# EasyEDA Pro project ProPrj_基于STM32的多功能串口分析仪_2025-03-12.epro, schematic Schematic3
Board Name: 锂电池供电小板; Create Date: 2025-02-12; Page Name: P1; Project Name: 基于STM32的多功能串口分析仪; Schematic Name: Schematic3; Update Date: 2025-02-17; Company: 嘉立创EDA; Page Size: A4; Version: V1.0
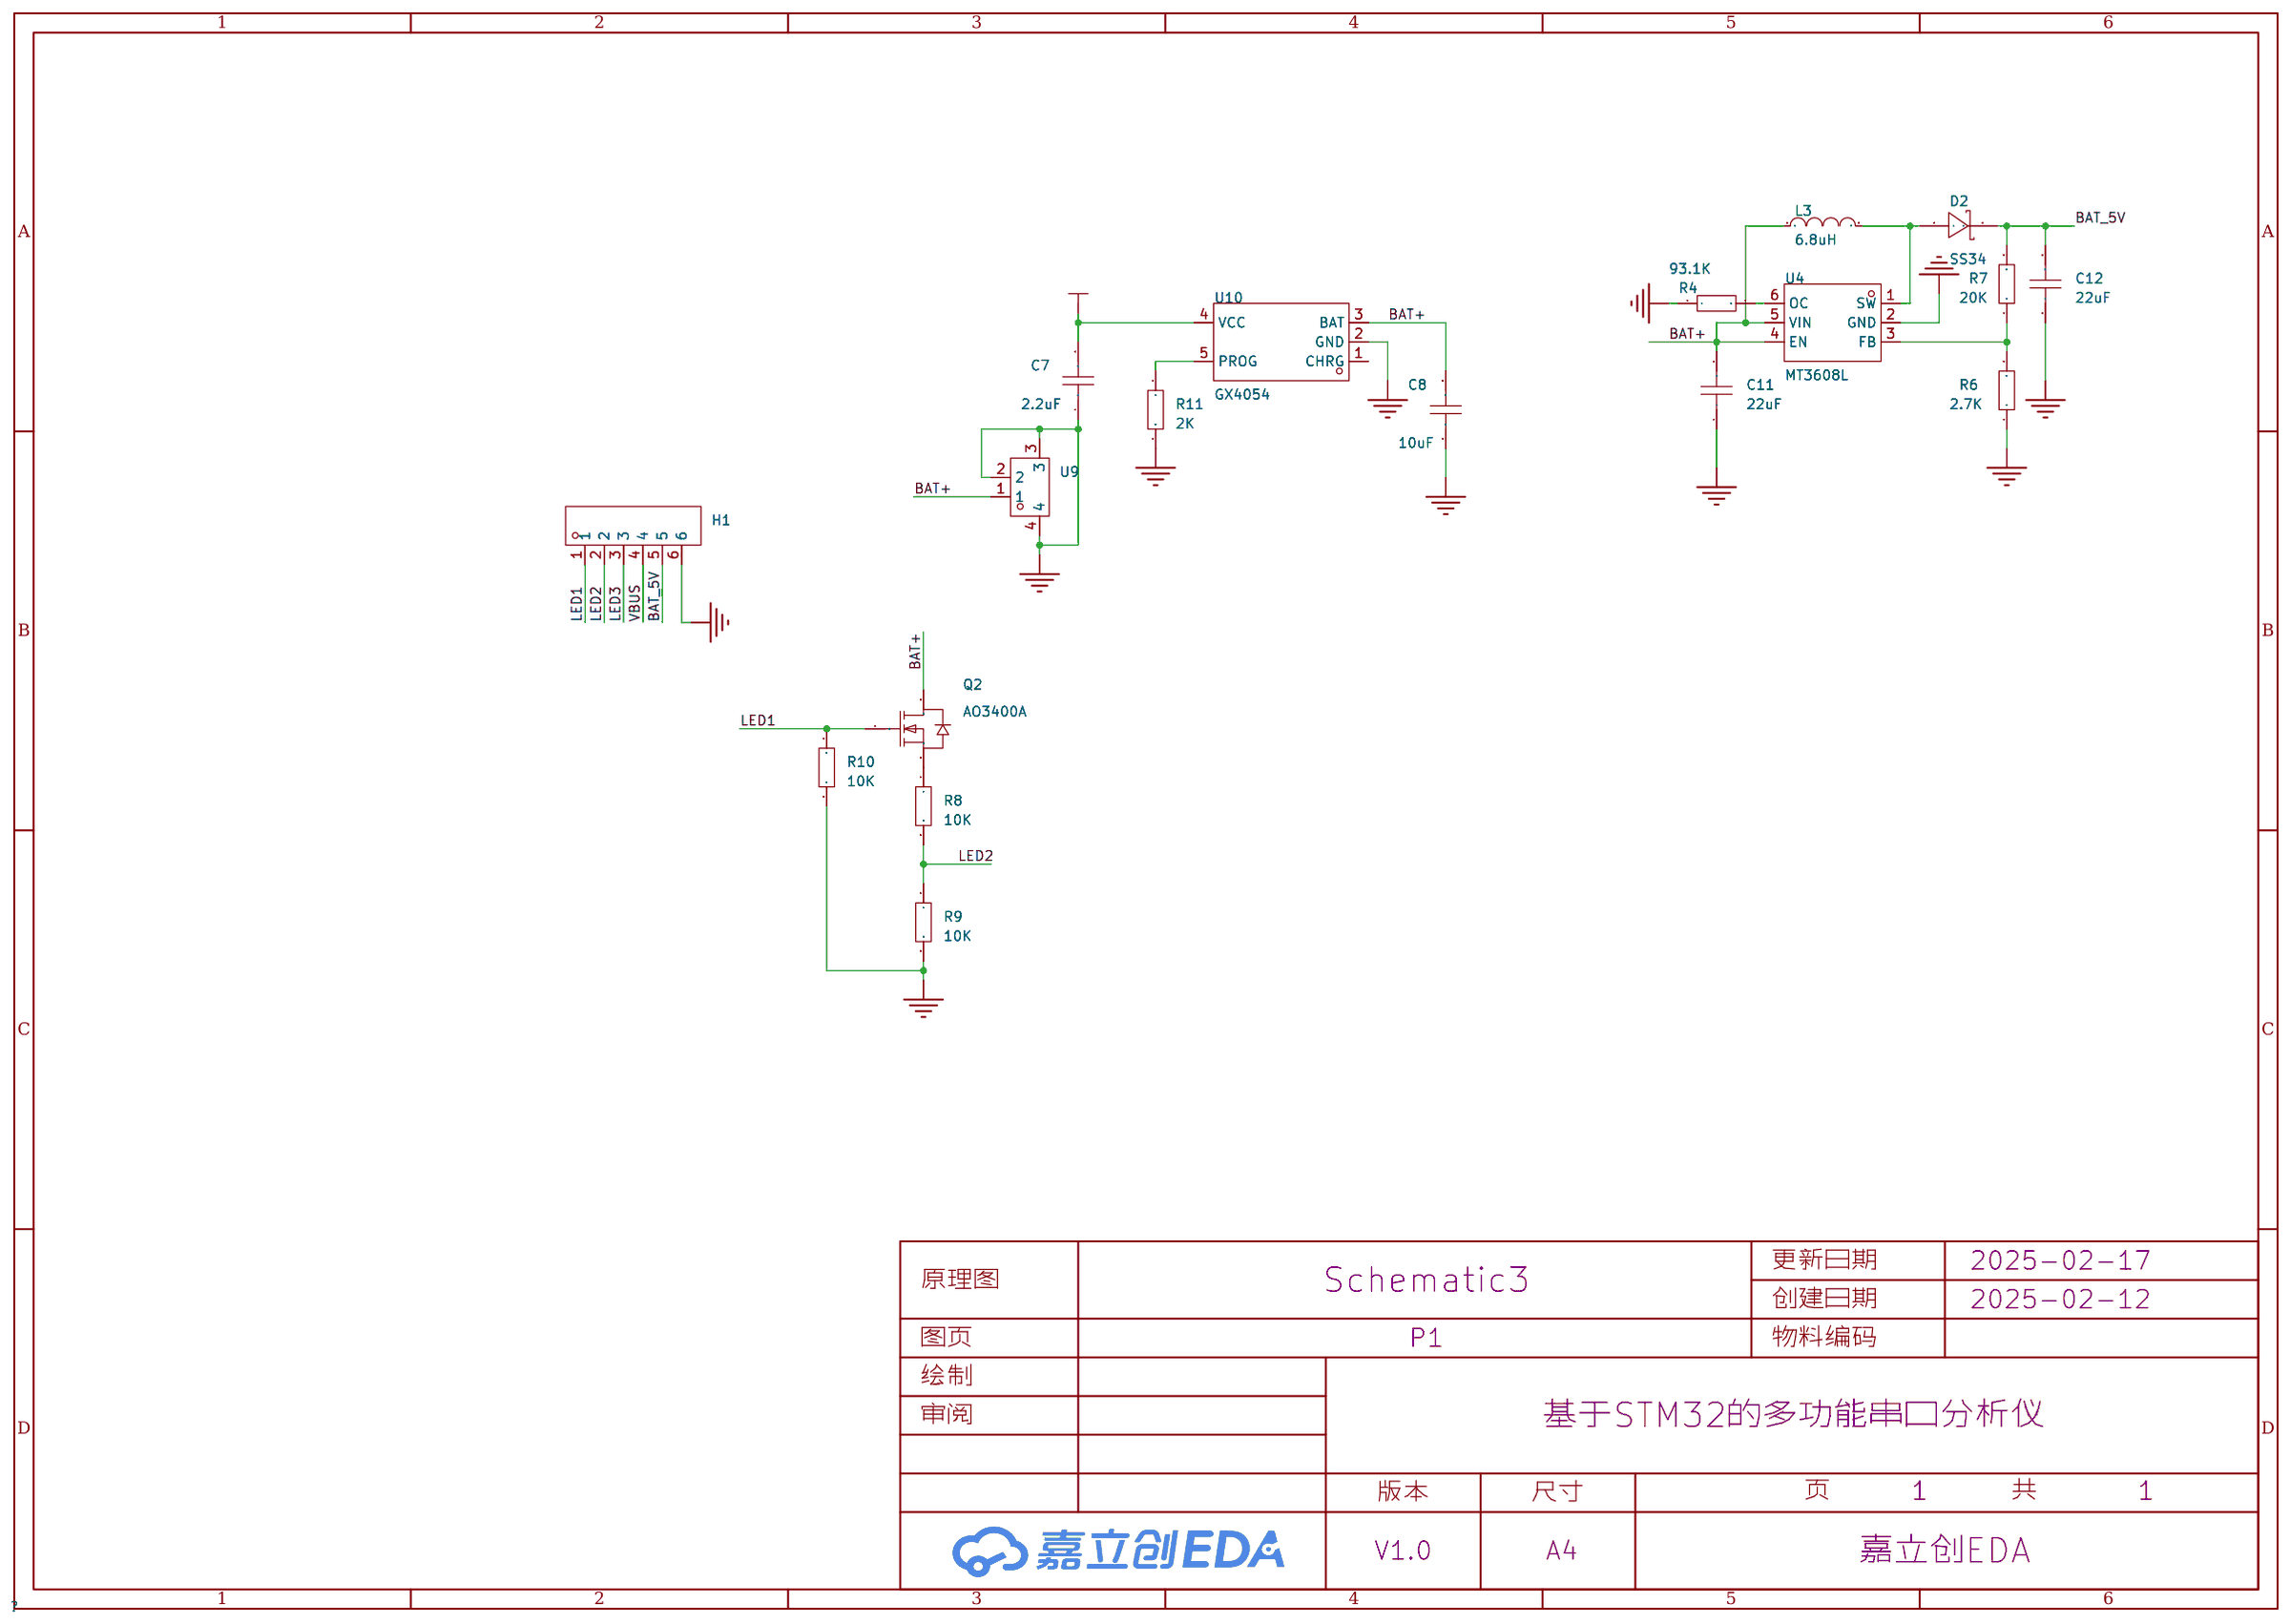
[diagram p7: schematic sheet]

## Parts
C7  2.2uF  [C0603]
C8  10uF  [C0603]
C11  22uF  [C0805]
C12  22uF  [C0805]
D2  SS34  [SMA_L4.3-W2.6-LS5.0-RD]
H1  -  [HDR-TH_6P-P2.54-V-F]
L3  6.8uH  [IND-SMD_L2.5-W2.0_FHD252010S-6R8MT]
Q2  AO3400A  [SOT-23-3_L2.9-W1.3-P1.90-LS2.4-BR]
R4  93.1K  [R0603]
R6  2.7K  [R0603]
R7  20K  [R0603]
R8  10K  [R0603]
R9  10K  [R0603]
R10  10K  [R0603]
R11  2K  [R0603]
U4  MT3608L  [SOT-23-6_L2.9-W1.6-P0.95-LS2.8-BL_3]
U9  ZX-XH2.54-2PLT  [BAT+]
U10  GX4054  [SOT-23-5_L2.9-W1.6-P0.95-LS2.8-BR]

## Library data of the parts
C7 C8 = CAP_0603: Supplier Footprint: 0603
C11 C12 = CAP_0805: Supplier Footprint: 0805
D2 = SS34: Supplier Part: C9900023345; Supplier Footprint: SMA,DO-214AC; JLCPCB Part Class: 扩展库; Supplier: LCSC
H1 = HDR-F_2.54_1x6P: Supplier Part: C40877; Supplier Footprint: 插件
L3 = FHD252010S-6R8MT: 电感值:6.8uH;精度:±20%;额定电流:1A;饱和电流(Isat):1.15A;; LCSC Part Name: 6.8uH ±20% 1.15A; Supplier Part: C602006; Manufacturer: cjiang(长江微电); Supplier Footprint: 1008; Datasheet: https://atta.szlcsc.com/upload/public/pdf/source/20200609/C601990_BCEA243EC4DA0A9A288AA78A6DFB48A5.pdf; Supplier: LCSC; Tolerance: ±20%; Rated Current: 1A; Saturation Current (Isat): 1.15A; DC Resistance (DCR): 380mΩ
Q2 = AO3400A_C20917: 类型:1个N沟道;漏源电压(Vdss):30V;连续漏极电流(Id):5.7A;导通电阻(RDS(on)@Vgs,Id):26.5mΩ@10V,5.7A;功率(Pd):1.4W;阈值电压(Vgs(th)@Id):1.5V@250uA;; LCSC Part Name: 1个N沟道 耐压:30V 电流:5.7A; Supplier Part: C20917; Manufacturer: AOS; Supplier Footprint: SOT-23-3L; JLCPCB Part Class: 基础库; Datasheet: https://atta.szlcsc.com/upload/public/pdf/source/20140107/1457706668533.pdf; Supplier: LCSC; Type: 1个N沟道; Drain Source Voltage (Vdss): 30V; Continuous Drain Current (Id): 5.7A; Drain Source On Resistance (RDS(on)@Vgs,Id): 26.5mΩ@10V,5.7A; Power Dissipation (Pd): 1.4W; Gate Threshold Voltage (Vgs(th)@Id): 1.5V@250uA; Total Gate Charge (Qg@Vgs): 7nC@4.5V; Input Capacitance (Ciss@Vds): 630pF@15V; Operating Temperature: -55℃~+150℃@(Tj)
R4 R6-R11 = Res_0603: Supplier Footprint: 0603
U4 = MT3608L: Supplier Part: C2932326; Manufacturer: 西安航天民芯; Supplier Footprint: SOT-23-6; Datasheet: https://atta.szlcsc.com/upload/public/pdf/source/20211213/953A62CC1033762E00AABAD4906DD7F1.pdf; Supplier: LCSC
U9 = ZX-XH2.54-2PLT: 插针结构:1x2P;间距:2.54mm;安装方式:立贴;参考系列:XH;总PIN数:2P;排数:1;每排PIN数:2;行距:-;额定电流:3A;触头材质:黄铜;触头镀层:锡;工作温度范围:-25℃~+85℃;; Supplier Part: C7429680; Manufacturer: Megastar(兆星); Supplier Footprint: SMD,P=2.54mm; Datasheet: https://atta.szlcsc.com/upload/public/pdf/source/20230619/87C018EBE425F10E4B035B436CF5FBBC.pdf; Supplier: LCSC; Pins Structure: 1x2P; Pitch: 2.54mm; Mounting Style: 立贴; Reference Series: XH; Number of Pins: 2P; Number of Rows: 1; Number of PINs Per Row: 2; Current Rating (Max): 3A; Contact Material: 黄铜; Contact Plating: 锡; Operating Temperature Range: -25℃~+85℃
U10 = GX4054: 最大充电电流:500mA;; Supplier Part: C5259235; Manufacturer: 国芯佳品; Supplier Footprint: SOT-23-5L; JLCPCB Part Class: 扩展库; Datasheet: https://atta.szlcsc.com/upload/public/pdf/source/20231117/282E3D86D21E4B74B8836E6CF123CD3A.pdf; Supplier: LCSC; Maximum Charge Current: 500mA

## Nets
GND: C7.1 C8.1 C11.1 C12.1 H1.6 R4.1 R6.1 R9.2 R10.2 R11.2 U4.2(GND) U9.2 U9.3 U9.4 U10.2(GND)
VBUS: C7.2 H1.4 U10.4(VCC)
BAT+: C8.2 C11.2 L3.1 Q2.3(D) U4.4(EN) U4.5(VIN) U9.1 U10.3(BAT)
BAT_5V: C12.2 D2.1(K) H1.5 R7.2
LED1: H1.1 Q2.1(G) R10.1
LED2: H1.2 R8.2 R9.1
LED3: H1.3
$1N2053: D2.2(A) L3.2 U4.1(SW)
$1N2057: R4.2 U4.6(OC)
$1N2060: R6.2 R7.1 U4.3(FB)
$1N3228: R11.1 U10.5(PROG)
$1N4277: Q2.2(S) R8.1

Not connected (* = marked no-connect by the designer): U10 1(CHRG)
